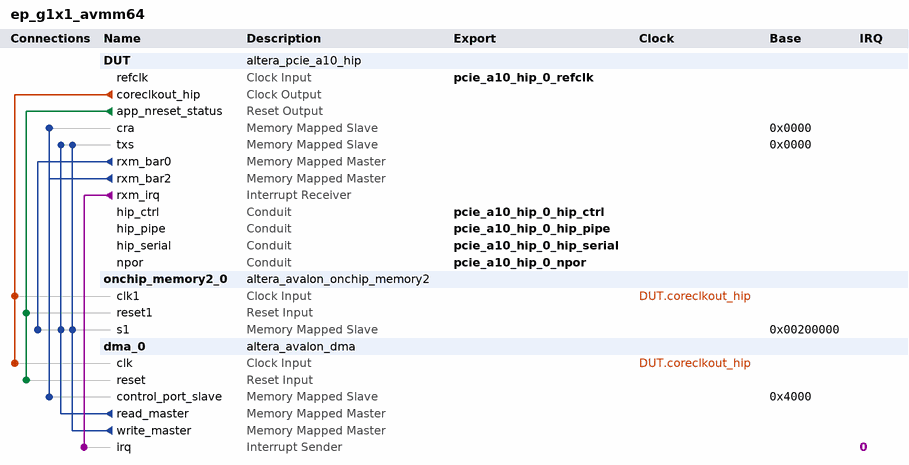
[diagram p0: system contents]
# Platform Designer (Qsys) system ep_g1x1_avmm64, Arria 10 10AX115S1F45I1SG
# Parameters at their usual value, and those the tool derives, are not listed.
package require -exact qsys 17.0
create_system ep_g1x1_avmm64
set_project_property DEVICE_FAMILY {Arria 10}
set_project_property DEVICE 10AX115S1F45I1SG

add_instance DUT altera_pcie_a10_hip 17.0
set_instance_parameter_value DUT adme_enable_hwtcl 0
set_instance_parameter_value DUT advance_error_reporting_hwtcl 0
set_instance_parameter_value DUT apps_type_hwtcl 0
set_instance_parameter_value DUT ari_support_hwtcl 0
set_instance_parameter_value DUT ast_trs_num_desc_hwtcl 16
set_instance_parameter_value DUT ast_trs_rxdata_width_hwtcl 256
set_instance_parameter_value DUT ast_trs_rxdesc_width_hwtcl 256
set_instance_parameter_value DUT ast_trs_rxmty_width_hwtcl 32
set_instance_parameter_value DUT ast_trs_txdata_width_hwtcl 256
set_instance_parameter_value DUT ast_trs_txdesc_width_hwtcl 256
set_instance_parameter_value DUT ast_trs_txmty_width_hwtcl 32
set_instance_parameter_value DUT ast_trs_txstatus_width_hwtcl 256
set_instance_parameter_value DUT avmm_addr_width_hwtcl 32
set_instance_parameter_value DUT bar0_address_width_hwtcl 28
set_instance_parameter_value DUT bar0_type_hwtcl {64-bit prefetchable memory}
set_instance_parameter_value DUT bar1_address_width_hwtcl 0
set_instance_parameter_value DUT bar1_type_hwtcl Disabled
set_instance_parameter_value DUT bar2_address_width_hwtcl 0
set_instance_parameter_value DUT bar3_address_width_hwtcl 0
set_instance_parameter_value DUT bar3_type_hwtcl Disabled
set_instance_parameter_value DUT base_device NIGHTFURY5
set_instance_parameter_value DUT bfm_drive_interface_clk_hwtcl 1
set_instance_parameter_value DUT bfm_drive_interface_control_hwtcl 1
set_instance_parameter_value DUT bfm_drive_interface_npor_hwtcl 1
set_instance_parameter_value DUT bfm_drive_interface_pipe_hwtcl 1
set_instance_parameter_value DUT cg_a2p_addr_map_pass_thru_bits_hwtcl 20
set_instance_parameter_value DUT cg_enable_a2p_interrupt_hwtcl 0
set_instance_parameter_value DUT cg_enable_advanced_interrupt_hwtcl 0
set_instance_parameter_value DUT class_code_hwtcl 0
set_instance_parameter_value DUT completion_timeout_hwtcl ABCD
set_instance_parameter_value DUT cseb_autonomous_hwtcl 0
set_instance_parameter_value DUT cseb_config_bypass_hwtcl 0
set_instance_parameter_value DUT devhide_support_hwtcl 0
set_instance_parameter_value DUT device_embedded_ep_support_hwtcl 0
set_instance_parameter_value DUT device_id_hwtcl 57345
set_instance_parameter_value DUT dis_adapt 0
set_instance_parameter_value DUT dma_use_scfifo_ext_hwtcl 0
set_instance_parameter_value DUT ecrc_check_capable_hwtcl 0
set_instance_parameter_value DUT ecrc_gen_capable_hwtcl 0
set_instance_parameter_value DUT enable_ast_trs_hwtcl 0
set_instance_parameter_value DUT enable_avst_reset_hwtcl 0
set_instance_parameter_value DUT enable_custom_features_hwtcl 0
set_instance_parameter_value DUT enable_devkit_conduit_hwtcl 0
set_instance_parameter_value DUT enable_example_design_qii_hwtcl 0
set_instance_parameter_value DUT enable_example_design_sim_hwtcl 0
set_instance_parameter_value DUT enable_example_design_synth_hwtcl 0
set_instance_parameter_value DUT enable_example_design_tb_hwtcl 0
set_instance_parameter_value DUT enable_gen3phase2eq_timechange 0
set_instance_parameter_value DUT enable_hip_status_for_avmm_hwtcl 0
set_instance_parameter_value DUT enable_lmi_hwtcl 0
set_instance_parameter_value DUT enable_nobar_slection_hwtcl 0
set_instance_parameter_value DUT enable_rxm_burst_hwtcl 0
set_instance_parameter_value DUT enable_skp_det 0
set_instance_parameter_value DUT enable_soft_dfe 0
set_instance_parameter_value DUT export_fpll_output_to_top_level_hwtcl 0
set_instance_parameter_value DUT export_phy_input_to_top_level_hwtcl 0
set_instance_parameter_value DUT extended_tag_support_hwtcl 0
set_instance_parameter_value DUT flr_capability_user_hwtcl 0
set_instance_parameter_value DUT force_tag_checking_on_hwtcl 0
set_instance_parameter_value DUT gen3_coeff_1_hwtcl 9
set_instance_parameter_value DUT gen3_coeff_3_ber_meas_hwtcl 12ms
set_instance_parameter_value DUT interface_type_hwtcl Avalon-MM
set_instance_parameter_value DUT internal_controller_hwtcl 0
set_instance_parameter_value DUT link2csr_width_hwtcl 16
set_instance_parameter_value DUT maximum_payload_size_hwtcl 128
set_instance_parameter_value DUT part_trait_device 10AX115S1F45I1SG
set_instance_parameter_value DUT pf0_ats_invalidate_queue_depth_hwtcl 0
set_instance_parameter_value DUT pf0_bar0_prefetchable_hwtcl 1
set_instance_parameter_value DUT pf0_bar0_present_hwtcl 1
set_instance_parameter_value DUT pf0_bar0_size_hwtcl 12
set_instance_parameter_value DUT pf0_bar0_type_hwtcl 1
set_instance_parameter_value DUT pf0_bar1_prefetchable_hwtcl 1
set_instance_parameter_value DUT pf0_bar1_present_hwtcl 0
set_instance_parameter_value DUT pf0_bar1_size_hwtcl 12
set_instance_parameter_value DUT pf0_bar2_prefetchable_hwtcl 1
set_instance_parameter_value DUT pf0_bar2_present_hwtcl 0
set_instance_parameter_value DUT pf0_bar2_size_hwtcl 12
set_instance_parameter_value DUT pf0_bar2_type_hwtcl 1
set_instance_parameter_value DUT pf0_bar3_prefetchable_hwtcl 1
set_instance_parameter_value DUT pf0_bar3_present_hwtcl 0
set_instance_parameter_value DUT pf0_bar3_size_hwtcl 12
set_instance_parameter_value DUT pf0_bar4_prefetchable_hwtcl 1
set_instance_parameter_value DUT pf0_bar4_present_hwtcl 0
set_instance_parameter_value DUT pf0_bar4_size_hwtcl 12
set_instance_parameter_value DUT pf0_bar4_type_hwtcl 1
set_instance_parameter_value DUT pf0_bar5_prefetchable_hwtcl 1
set_instance_parameter_value DUT pf0_bar5_present_hwtcl 0
set_instance_parameter_value DUT pf0_bar5_size_hwtcl 12
set_instance_parameter_value DUT pf0_extra_bar_present_hwtcl 0
set_instance_parameter_value DUT pf0_extra_bar_size_hwtcl 12
set_instance_parameter_value DUT pf0_interrupt_pin_hwtcl inta
set_instance_parameter_value DUT pf0_intr_line_hwtcl 0
set_instance_parameter_value DUT pf0_msi_multi_message_capable_hwtcl 4
set_instance_parameter_value DUT pf0_msix_pba_bir_hwtcl 0
set_instance_parameter_value DUT pf0_msix_pba_offset_hwtcl 0
set_instance_parameter_value DUT pf0_msix_table_bir_hwtcl 0
set_instance_parameter_value DUT pf0_msix_table_offset_hwtcl 0
set_instance_parameter_value DUT pf0_msix_table_size_hwtcl 0
set_instance_parameter_value DUT pf0_subclass_code_hwtcl 0
set_instance_parameter_value DUT pf0_tph_dev_specific_mode_support_hwtcl 0
set_instance_parameter_value DUT pf0_tph_int_mode_support_hwtcl 0
set_instance_parameter_value DUT pf0_tph_st_table_location_hwtcl 0
set_instance_parameter_value DUT pf0_tph_st_table_size_hwtcl 63
set_instance_parameter_value DUT pf0_vf_bar0_prefetchable_hwtcl 1
set_instance_parameter_value DUT pf0_vf_bar0_present_hwtcl 0
set_instance_parameter_value DUT pf0_vf_bar0_size_hwtcl 12
set_instance_parameter_value DUT pf0_vf_bar0_type_hwtcl 1
set_instance_parameter_value DUT pf0_vf_bar1_prefetchable_hwtcl 1
set_instance_parameter_value DUT pf0_vf_bar1_present_hwtcl 0
set_instance_parameter_value DUT pf0_vf_bar1_size_hwtcl 12
set_instance_parameter_value DUT pf0_vf_bar2_prefetchable_hwtcl 1
set_instance_parameter_value DUT pf0_vf_bar2_present_hwtcl 0
set_instance_parameter_value DUT pf0_vf_bar2_size_hwtcl 12
set_instance_parameter_value DUT pf0_vf_bar2_type_hwtcl 1
set_instance_parameter_value DUT pf0_vf_bar3_prefetchable_hwtcl 1
set_instance_parameter_value DUT pf0_vf_bar3_present_hwtcl 0
set_instance_parameter_value DUT pf0_vf_bar3_size_hwtcl 12
set_instance_parameter_value DUT pf0_vf_bar4_prefetchable_hwtcl 1
set_instance_parameter_value DUT pf0_vf_bar4_present_hwtcl 0
set_instance_parameter_value DUT pf0_vf_bar4_size_hwtcl 12
set_instance_parameter_value DUT pf0_vf_bar4_type_hwtcl 1
set_instance_parameter_value DUT pf0_vf_bar5_prefetchable_hwtcl 1
set_instance_parameter_value DUT pf0_vf_bar5_present_hwtcl 0
set_instance_parameter_value DUT pf0_vf_bar5_size_hwtcl 12
set_instance_parameter_value DUT pf0_vf_count_user_hwtcl 0
set_instance_parameter_value DUT pf0_vf_device_id_hwtcl 0
set_instance_parameter_value DUT pf0_vf_msix_pba_bir_hwtcl 0
set_instance_parameter_value DUT pf0_vf_msix_pba_offset_hwtcl 0
set_instance_parameter_value DUT pf0_vf_msix_tbl_bir_hwtcl 0
set_instance_parameter_value DUT pf0_vf_msix_tbl_offset_hwtcl 0
set_instance_parameter_value DUT pf0_vf_msix_tbl_size_hwtcl 0
set_instance_parameter_value DUT pf0_vf_tph_dev_specific_mode_support_hwtcl 0
set_instance_parameter_value DUT pf0_vf_tph_int_mode_support_hwtcl 0
set_instance_parameter_value DUT pf0_vf_tph_st_table_location_hwtcl 0
set_instance_parameter_value DUT pf0_vf_tph_st_table_size_hwtcl 63
set_instance_parameter_value DUT pf1_ats_invalidate_queue_depth_hwtcl 0
set_instance_parameter_value DUT pf1_bar0_prefetchable_hwtcl 1
set_instance_parameter_value DUT pf1_bar0_present_hwtcl 0
set_instance_parameter_value DUT pf1_bar0_size_hwtcl 12
set_instance_parameter_value DUT pf1_bar0_type_hwtcl 1
set_instance_parameter_value DUT pf1_bar1_prefetchable_hwtcl 1
set_instance_parameter_value DUT pf1_bar1_present_hwtcl 0
set_instance_parameter_value DUT pf1_bar1_size_hwtcl 12
set_instance_parameter_value DUT pf1_bar2_prefetchable_hwtcl 1
set_instance_parameter_value DUT pf1_bar2_present_hwtcl 0
set_instance_parameter_value DUT pf1_bar2_size_hwtcl 12
set_instance_parameter_value DUT pf1_bar2_type_hwtcl 1
set_instance_parameter_value DUT pf1_bar3_prefetchable_hwtcl 1
set_instance_parameter_value DUT pf1_bar3_present_hwtcl 0
set_instance_parameter_value DUT pf1_bar3_size_hwtcl 12
set_instance_parameter_value DUT pf1_bar4_prefetchable_hwtcl 1
set_instance_parameter_value DUT pf1_bar4_present_hwtcl 0
set_instance_parameter_value DUT pf1_bar4_size_hwtcl 12
set_instance_parameter_value DUT pf1_bar4_type_hwtcl 1
set_instance_parameter_value DUT pf1_bar5_prefetchable_hwtcl 1
set_instance_parameter_value DUT pf1_bar5_present_hwtcl 0
set_instance_parameter_value DUT pf1_bar5_size_hwtcl 12
set_instance_parameter_value DUT pf1_class_code_hwtcl 0
set_instance_parameter_value DUT pf1_device_id_hwtcl 0
set_instance_parameter_value DUT pf1_interrupt_pin_hwtcl inta
set_instance_parameter_value DUT pf1_intr_line_hwtcl 0
set_instance_parameter_value DUT pf1_msi_multi_message_capable_hwtcl 4
set_instance_parameter_value DUT pf1_msix_pba_bir_hwtcl 0
set_instance_parameter_value DUT pf1_msix_pba_offset_hwtcl 0
set_instance_parameter_value DUT pf1_msix_table_bir_hwtcl 0
set_instance_parameter_value DUT pf1_msix_table_offset_hwtcl 0
set_instance_parameter_value DUT pf1_msix_table_size_hwtcl 0
set_instance_parameter_value DUT pf1_revision_id_hwtcl 0
set_instance_parameter_value DUT pf1_subclass_code_hwtcl 0
set_instance_parameter_value DUT pf1_subsystem_device_id_hwtcl 0
set_instance_parameter_value DUT pf1_subsystem_vendor_id_hwtcl 0
set_instance_parameter_value DUT pf1_tph_dev_specific_mode_support_hwtcl 0
set_instance_parameter_value DUT pf1_tph_int_mode_support_hwtcl 0
set_instance_parameter_value DUT pf1_tph_st_table_location_hwtcl 0
set_instance_parameter_value DUT pf1_tph_st_table_size_hwtcl 63
set_instance_parameter_value DUT pf1_vendor_id_hwtcl 0
set_instance_parameter_value DUT pf1_vf_bar0_prefetchable_hwtcl 1
set_instance_parameter_value DUT pf1_vf_bar0_present_hwtcl 0
set_instance_parameter_value DUT pf1_vf_bar0_size_hwtcl 12
set_instance_parameter_value DUT pf1_vf_bar0_type_hwtcl 1
set_instance_parameter_value DUT pf1_vf_bar1_prefetchable_hwtcl 1
set_instance_parameter_value DUT pf1_vf_bar1_present_hwtcl 0
set_instance_parameter_value DUT pf1_vf_bar1_size_hwtcl 12
set_instance_parameter_value DUT pf1_vf_bar2_prefetchable_hwtcl 1
set_instance_parameter_value DUT pf1_vf_bar2_present_hwtcl 0
set_instance_parameter_value DUT pf1_vf_bar2_size_hwtcl 12
set_instance_parameter_value DUT pf1_vf_bar2_type_hwtcl 1
set_instance_parameter_value DUT pf1_vf_bar3_prefetchable_hwtcl 1
set_instance_parameter_value DUT pf1_vf_bar3_present_hwtcl 0
set_instance_parameter_value DUT pf1_vf_bar3_size_hwtcl 12
set_instance_parameter_value DUT pf1_vf_bar4_prefetchable_hwtcl 1
set_instance_parameter_value DUT pf1_vf_bar4_present_hwtcl 0
set_instance_parameter_value DUT pf1_vf_bar4_size_hwtcl 12
set_instance_parameter_value DUT pf1_vf_bar4_type_hwtcl 1
set_instance_parameter_value DUT pf1_vf_bar5_prefetchable_hwtcl 1
set_instance_parameter_value DUT pf1_vf_bar5_present_hwtcl 0
set_instance_parameter_value DUT pf1_vf_bar5_size_hwtcl 12
set_instance_parameter_value DUT pf1_vf_count_user_hwtcl 0
set_instance_parameter_value DUT pf1_vf_device_id_hwtcl 0
set_instance_parameter_value DUT pf1_vf_msix_pba_bir_hwtcl 0
set_instance_parameter_value DUT pf1_vf_msix_pba_offset_hwtcl 0
set_instance_parameter_value DUT pf1_vf_msix_tbl_bir_hwtcl 0
set_instance_parameter_value DUT pf1_vf_msix_tbl_offset_hwtcl 0
set_instance_parameter_value DUT pf1_vf_msix_tbl_size_hwtcl 0
set_instance_parameter_value DUT pf1_vf_tph_dev_specific_mode_support_hwtcl 0
set_instance_parameter_value DUT pf1_vf_tph_int_mode_support_hwtcl 0
set_instance_parameter_value DUT pf1_vf_tph_st_table_location_hwtcl 0
set_instance_parameter_value DUT pf1_vf_tph_st_table_size_hwtcl 63
set_instance_parameter_value DUT pf2_ats_invalidate_queue_depth_hwtcl 0
set_instance_parameter_value DUT pf2_bar0_prefetchable_hwtcl 1
set_instance_parameter_value DUT pf2_bar0_present_hwtcl 0
set_instance_parameter_value DUT pf2_bar0_size_hwtcl 12
set_instance_parameter_value DUT pf2_bar0_type_hwtcl 1
set_instance_parameter_value DUT pf2_bar1_prefetchable_hwtcl 1
set_instance_parameter_value DUT pf2_bar1_present_hwtcl 0
set_instance_parameter_value DUT pf2_bar1_size_hwtcl 12
set_instance_parameter_value DUT pf2_bar2_prefetchable_hwtcl 1
set_instance_parameter_value DUT pf2_bar2_present_hwtcl 0
set_instance_parameter_value DUT pf2_bar2_size_hwtcl 12
set_instance_parameter_value DUT pf2_bar2_type_hwtcl 1
set_instance_parameter_value DUT pf2_bar3_prefetchable_hwtcl 1
set_instance_parameter_value DUT pf2_bar3_present_hwtcl 0
set_instance_parameter_value DUT pf2_bar3_size_hwtcl 12
set_instance_parameter_value DUT pf2_bar4_prefetchable_hwtcl 1
set_instance_parameter_value DUT pf2_bar4_present_hwtcl 0
set_instance_parameter_value DUT pf2_bar4_size_hwtcl 12
set_instance_parameter_value DUT pf2_bar4_type_hwtcl 1
set_instance_parameter_value DUT pf2_bar5_prefetchable_hwtcl 1
set_instance_parameter_value DUT pf2_bar5_present_hwtcl 0
set_instance_parameter_value DUT pf2_bar5_size_hwtcl 12
set_instance_parameter_value DUT pf2_class_code_hwtcl 0
set_instance_parameter_value DUT pf2_device_id_hwtcl 0
set_instance_parameter_value DUT pf2_interrupt_pin_hwtcl inta
set_instance_parameter_value DUT pf2_intr_line_hwtcl 0
set_instance_parameter_value DUT pf2_msi_multi_message_capable_hwtcl 4
set_instance_parameter_value DUT pf2_msix_pba_bir_hwtcl 0
set_instance_parameter_value DUT pf2_msix_pba_offset_hwtcl 0
set_instance_parameter_value DUT pf2_msix_table_bir_hwtcl 0
set_instance_parameter_value DUT pf2_msix_table_offset_hwtcl 0
set_instance_parameter_value DUT pf2_msix_table_size_hwtcl 0
set_instance_parameter_value DUT pf2_revision_id_hwtcl 0
set_instance_parameter_value DUT pf2_subclass_code_hwtcl 0
set_instance_parameter_value DUT pf2_subsystem_device_id_hwtcl 0
set_instance_parameter_value DUT pf2_subsystem_vendor_id_hwtcl 0
set_instance_parameter_value DUT pf2_tph_dev_specific_mode_support_hwtcl 0
set_instance_parameter_value DUT pf2_tph_int_mode_support_hwtcl 0
set_instance_parameter_value DUT pf2_tph_st_table_location_hwtcl 0
set_instance_parameter_value DUT pf2_tph_st_table_size_hwtcl 63
set_instance_parameter_value DUT pf2_vendor_id_hwtcl 0
set_instance_parameter_value DUT pf2_vf_bar0_prefetchable_hwtcl 1
set_instance_parameter_value DUT pf2_vf_bar0_present_hwtcl 0
set_instance_parameter_value DUT pf2_vf_bar0_size_hwtcl 12
set_instance_parameter_value DUT pf2_vf_bar0_type_hwtcl 1
set_instance_parameter_value DUT pf2_vf_bar1_prefetchable_hwtcl 1
set_instance_parameter_value DUT pf2_vf_bar1_present_hwtcl 0
set_instance_parameter_value DUT pf2_vf_bar1_size_hwtcl 12
set_instance_parameter_value DUT pf2_vf_bar2_prefetchable_hwtcl 1
set_instance_parameter_value DUT pf2_vf_bar2_present_hwtcl 0
set_instance_parameter_value DUT pf2_vf_bar2_size_hwtcl 12
set_instance_parameter_value DUT pf2_vf_bar2_type_hwtcl 1
set_instance_parameter_value DUT pf2_vf_bar3_prefetchable_hwtcl 1
set_instance_parameter_value DUT pf2_vf_bar3_present_hwtcl 0
set_instance_parameter_value DUT pf2_vf_bar3_size_hwtcl 12
set_instance_parameter_value DUT pf2_vf_bar4_prefetchable_hwtcl 1
set_instance_parameter_value DUT pf2_vf_bar4_present_hwtcl 0
set_instance_parameter_value DUT pf2_vf_bar4_size_hwtcl 12
set_instance_parameter_value DUT pf2_vf_bar4_type_hwtcl 1
set_instance_parameter_value DUT pf2_vf_bar5_prefetchable_hwtcl 1
set_instance_parameter_value DUT pf2_vf_bar5_present_hwtcl 0
set_instance_parameter_value DUT pf2_vf_bar5_size_hwtcl 12
set_instance_parameter_value DUT pf2_vf_count_user_hwtcl 0
set_instance_parameter_value DUT pf2_vf_device_id_hwtcl 0
set_instance_parameter_value DUT pf2_vf_msix_pba_bir_hwtcl 0
set_instance_parameter_value DUT pf2_vf_msix_pba_offset_hwtcl 0
set_instance_parameter_value DUT pf2_vf_msix_tbl_bir_hwtcl 0
set_instance_parameter_value DUT pf2_vf_msix_tbl_offset_hwtcl 0
set_instance_parameter_value DUT pf2_vf_msix_tbl_size_hwtcl 0
set_instance_parameter_value DUT pf2_vf_tph_dev_specific_mode_support_hwtcl 0
set_instance_parameter_value DUT pf2_vf_tph_int_mode_support_hwtcl 0
set_instance_parameter_value DUT pf2_vf_tph_st_table_location_hwtcl 0
set_instance_parameter_value DUT pf2_vf_tph_st_table_size_hwtcl 63
set_instance_parameter_value DUT pf3_ats_invalidate_queue_depth_hwtcl 0
set_instance_parameter_value DUT pf3_bar0_prefetchable_hwtcl 1
set_instance_parameter_value DUT pf3_bar0_present_hwtcl 0
set_instance_parameter_value DUT pf3_bar0_size_hwtcl 12
set_instance_parameter_value DUT pf3_bar0_type_hwtcl 1
set_instance_parameter_value DUT pf3_bar1_prefetchable_hwtcl 1
set_instance_parameter_value DUT pf3_bar1_present_hwtcl 0
set_instance_parameter_value DUT pf3_bar1_size_hwtcl 12
set_instance_parameter_value DUT pf3_bar2_prefetchable_hwtcl 1
set_instance_parameter_value DUT pf3_bar2_present_hwtcl 0
set_instance_parameter_value DUT pf3_bar2_size_hwtcl 12
set_instance_parameter_value DUT pf3_bar2_type_hwtcl 1
set_instance_parameter_value DUT pf3_bar3_prefetchable_hwtcl 1
set_instance_parameter_value DUT pf3_bar3_present_hwtcl 0
set_instance_parameter_value DUT pf3_bar3_size_hwtcl 12
set_instance_parameter_value DUT pf3_bar4_prefetchable_hwtcl 1
set_instance_parameter_value DUT pf3_bar4_present_hwtcl 0
set_instance_parameter_value DUT pf3_bar4_size_hwtcl 12
set_instance_parameter_value DUT pf3_bar4_type_hwtcl 1
set_instance_parameter_value DUT pf3_bar5_prefetchable_hwtcl 1
set_instance_parameter_value DUT pf3_bar5_present_hwtcl 0
set_instance_parameter_value DUT pf3_bar5_size_hwtcl 12
set_instance_parameter_value DUT pf3_class_code_hwtcl 0
set_instance_parameter_value DUT pf3_device_id_hwtcl 0
set_instance_parameter_value DUT pf3_interrupt_pin_hwtcl inta
set_instance_parameter_value DUT pf3_intr_line_hwtcl 0
set_instance_parameter_value DUT pf3_msi_multi_message_capable_hwtcl 4
set_instance_parameter_value DUT pf3_msix_pba_bir_hwtcl 0
set_instance_parameter_value DUT pf3_msix_pba_offset_hwtcl 0
set_instance_parameter_value DUT pf3_msix_table_bir_hwtcl 0
set_instance_parameter_value DUT pf3_msix_table_offset_hwtcl 0
set_instance_parameter_value DUT pf3_msix_table_size_hwtcl 0
set_instance_parameter_value DUT pf3_revision_id_hwtcl 0
set_instance_parameter_value DUT pf3_subclass_code_hwtcl 0
set_instance_parameter_value DUT pf3_subsystem_device_id_hwtcl 0
set_instance_parameter_value DUT pf3_subsystem_vendor_id_hwtcl 0
set_instance_parameter_value DUT pf3_tph_dev_specific_mode_support_hwtcl 0
set_instance_parameter_value DUT pf3_tph_int_mode_support_hwtcl 0
set_instance_parameter_value DUT pf3_tph_st_table_location_hwtcl 0
set_instance_parameter_value DUT pf3_tph_st_table_size_hwtcl 63
set_instance_parameter_value DUT pf3_vendor_id_hwtcl 0
set_instance_parameter_value DUT pf3_vf_bar0_prefetchable_hwtcl 1
set_instance_parameter_value DUT pf3_vf_bar0_present_hwtcl 0
set_instance_parameter_value DUT pf3_vf_bar0_size_hwtcl 12
set_instance_parameter_value DUT pf3_vf_bar0_type_hwtcl 1
set_instance_parameter_value DUT pf3_vf_bar1_prefetchable_hwtcl 1
set_instance_parameter_value DUT pf3_vf_bar1_present_hwtcl 0
set_instance_parameter_value DUT pf3_vf_bar1_size_hwtcl 12
set_instance_parameter_value DUT pf3_vf_bar2_prefetchable_hwtcl 1
set_instance_parameter_value DUT pf3_vf_bar2_present_hwtcl 0
set_instance_parameter_value DUT pf3_vf_bar2_size_hwtcl 12
set_instance_parameter_value DUT pf3_vf_bar2_type_hwtcl 1
set_instance_parameter_value DUT pf3_vf_bar3_prefetchable_hwtcl 1
set_instance_parameter_value DUT pf3_vf_bar3_present_hwtcl 0
set_instance_parameter_value DUT pf3_vf_bar3_size_hwtcl 12
set_instance_parameter_value DUT pf3_vf_bar4_prefetchable_hwtcl 1
set_instance_parameter_value DUT pf3_vf_bar4_present_hwtcl 0
set_instance_parameter_value DUT pf3_vf_bar4_size_hwtcl 12
set_instance_parameter_value DUT pf3_vf_bar4_type_hwtcl 1
set_instance_parameter_value DUT pf3_vf_bar5_prefetchable_hwtcl 1
set_instance_parameter_value DUT pf3_vf_bar5_present_hwtcl 0
set_instance_parameter_value DUT pf3_vf_bar5_size_hwtcl 12
set_instance_parameter_value DUT pf3_vf_count_user_hwtcl 0
set_instance_parameter_value DUT pf3_vf_device_id_hwtcl 0
set_instance_parameter_value DUT pf3_vf_msix_pba_bir_hwtcl 0
set_instance_parameter_value DUT pf3_vf_msix_pba_offset_hwtcl 0
set_instance_parameter_value DUT pf3_vf_msix_tbl_bir_hwtcl 0
set_instance_parameter_value DUT pf3_vf_msix_tbl_offset_hwtcl 0
set_instance_parameter_value DUT pf3_vf_msix_tbl_size_hwtcl 0
set_instance_parameter_value DUT pf3_vf_tph_dev_specific_mode_support_hwtcl 0
set_instance_parameter_value DUT pf3_vf_tph_int_mode_support_hwtcl 0
set_instance_parameter_value DUT pf3_vf_tph_st_table_location_hwtcl 0
set_instance_parameter_value DUT pf3_vf_tph_st_table_size_hwtcl 63
set_instance_parameter_value DUT pf_ats_support_hwtcl 0
set_instance_parameter_value DUT pf_enable_function_msix_support_hwtcl 0
set_instance_parameter_value DUT pf_msi_support_hwtcl 0
set_instance_parameter_value DUT pf_tph_support_hwtcl 0
set_instance_parameter_value DUT reserved_debug_hwtcl 0
set_instance_parameter_value DUT revision_id_hwtcl 0
set_instance_parameter_value DUT rx_buffer_credit_alloc_hwtcl Low
set_instance_parameter_value DUT rx_cred_ctl_param_hwtcl 0
set_instance_parameter_value DUT rx_polinv_soft_logic_enable 0
set_instance_parameter_value DUT select_design_example_hwtcl PIO
set_instance_parameter_value DUT select_design_example_rtl_lang_hwtcl Verilog
set_instance_parameter_value DUT slave_address_map_0_hwtcl 22
set_instance_parameter_value DUT slave_address_map_2_hprxm_hwtcl 0
set_instance_parameter_value DUT slave_address_map_2_hwtcl 15
set_instance_parameter_value DUT slot_clock_cfg_hwtcl 1
set_instance_parameter_value DUT speed_change_hwtcl 0
set_instance_parameter_value DUT sr_iov_support_hwtcl 0
set_instance_parameter_value DUT sriov2_en 0
set_instance_parameter_value DUT subsystem_device_id_hwtcl 0
set_instance_parameter_value DUT subsystem_vendor_id_hwtcl 0
set_instance_parameter_value DUT system_page_sizes_supported_hwtcl 1363
set_instance_parameter_value DUT targeted_devkit_hwtcl {Arria 10 GX FPGA Development Kit}
set_instance_parameter_value DUT test_cseb_switch_hwtcl 0
set_instance_parameter_value DUT tlp_insp_trg_dw0_hwtcl 2049
set_instance_parameter_value DUT tlp_insp_trg_dw1_hwtcl 0
set_instance_parameter_value DUT tlp_insp_trg_dw2_hwtcl 0
set_instance_parameter_value DUT tlp_inspector_hwtcl 0
set_instance_parameter_value DUT tlp_inspector_use_signal_probe_hwtcl 0
set_instance_parameter_value DUT tlp_inspector_use_thin_rx_master 0
set_instance_parameter_value DUT total_pf_count_hwtcl 1
set_instance_parameter_value DUT use_dynamic_design_example_hwtcl 1
set_instance_parameter_value DUT use_rpbfm_pro 0
set_instance_parameter_value DUT user_id_hwtcl 0
set_instance_parameter_value DUT user_txs_addr_width_hwtcl 32
set_instance_parameter_value DUT vendor_id_hwtcl 4466
set_instance_parameter_value DUT vf_ats_support_hwtcl 0
set_instance_parameter_value DUT vf_msix_cap_present_hwtcl 0
set_instance_parameter_value DUT vf_tph_support_hwtcl 0
set_instance_parameter_value DUT vsec_cap_hwtcl 0
set_instance_parameter_value DUT vsec_id_hwtcl 4466
set_instance_parameter_value DUT wrala_hwtcl 16
set_instance_parameter_value DUT xcvr_reconfig_hwtcl 0

add_instance onchip_memory2_0 altera_avalon_onchip_memory2 17.0
set_instance_parameter_value onchip_memory2_0 dataWidth 64
set_instance_parameter_value onchip_memory2_0 dualPort false
set_instance_parameter_value onchip_memory2_0 initMemContent false
set_instance_parameter_value onchip_memory2_0 initializationFileName onchip_mem.hex
set_instance_parameter_value onchip_memory2_0 memorySize 4096

add_instance dma_0 altera_avalon_dma 17.0
set_instance_parameter_value dma_0 allowByteTransactions true
set_instance_parameter_value dma_0 allowDoubleWordTransactions true
set_instance_parameter_value dma_0 allowHalfWordTransactions true
set_instance_parameter_value dma_0 allowQuadWordTransactions true
set_instance_parameter_value dma_0 burstEnable true
set_instance_parameter_value dma_0 fifoDepth 32
set_instance_parameter_value dma_0 maxBurstSize 128
set_instance_parameter_value dma_0 minimumDmaTransactionRegisterWidth 13

# connections
add_connection DUT.coreclkout_hip dma_0.clk clock
add_connection DUT.coreclkout_hip onchip_memory2_0.clk1 clock
add_connection DUT.app_nreset_status dma_0.reset reset
add_connection DUT.app_nreset_status onchip_memory2_0.reset1 reset
add_connection dma_0.read_master DUT.txs avalon
set_connection_parameter_value dma_0.read_master/DUT.txs baseAddress 0x0000
add_connection dma_0.read_master onchip_memory2_0.s1 avalon
set_connection_parameter_value dma_0.read_master/onchip_memory2_0.s1 baseAddress 0x00200000
add_connection dma_0.write_master DUT.txs avalon
set_connection_parameter_value dma_0.write_master/DUT.txs baseAddress 0x0000
add_connection dma_0.write_master onchip_memory2_0.s1 avalon
set_connection_parameter_value dma_0.write_master/onchip_memory2_0.s1 baseAddress 0x00200000
add_connection DUT.rxm_bar0 onchip_memory2_0.s1 avalon
set_connection_parameter_value DUT.rxm_bar0/onchip_memory2_0.s1 baseAddress 0x00200000
add_connection DUT.rxm_bar2 dma_0.control_port_slave avalon
set_connection_parameter_value DUT.rxm_bar2/dma_0.control_port_slave baseAddress 0x4000
add_connection DUT.rxm_bar2 DUT.cra avalon
set_connection_parameter_value DUT.rxm_bar2/DUT.cra baseAddress 0x0000
add_connection DUT.rxm_irq dma_0.irq interrupt
set_connection_parameter_value DUT.rxm_irq/dma_0.irq irqNumber 0

# exported interfaces
add_interface pcie_a10_hip_0_hip_ctrl conduit end
set_interface_property pcie_a10_hip_0_hip_ctrl EXPORT_OF DUT.hip_ctrl
add_interface pcie_a10_hip_0_hip_pipe conduit end
set_interface_property pcie_a10_hip_0_hip_pipe EXPORT_OF DUT.hip_pipe
add_interface pcie_a10_hip_0_hip_serial conduit end
set_interface_property pcie_a10_hip_0_hip_serial EXPORT_OF DUT.hip_serial
add_interface pcie_a10_hip_0_npor conduit end
set_interface_property pcie_a10_hip_0_npor EXPORT_OF DUT.npor
add_interface pcie_a10_hip_0_refclk clock sink
set_interface_property pcie_a10_hip_0_refclk EXPORT_OF DUT.refclk

set_interconnect_requirement {$system} qsys_mm.clockCrossingAdapter HANDSHAKE
set_interconnect_requirement {$system} qsys_mm.maxAdditionalLatency 1

save_system ep_g1x1_avmm64.qsys
